# EAGLE schematic motherboard (EAGLE 9.1.2)

## Sheet 1 of 5
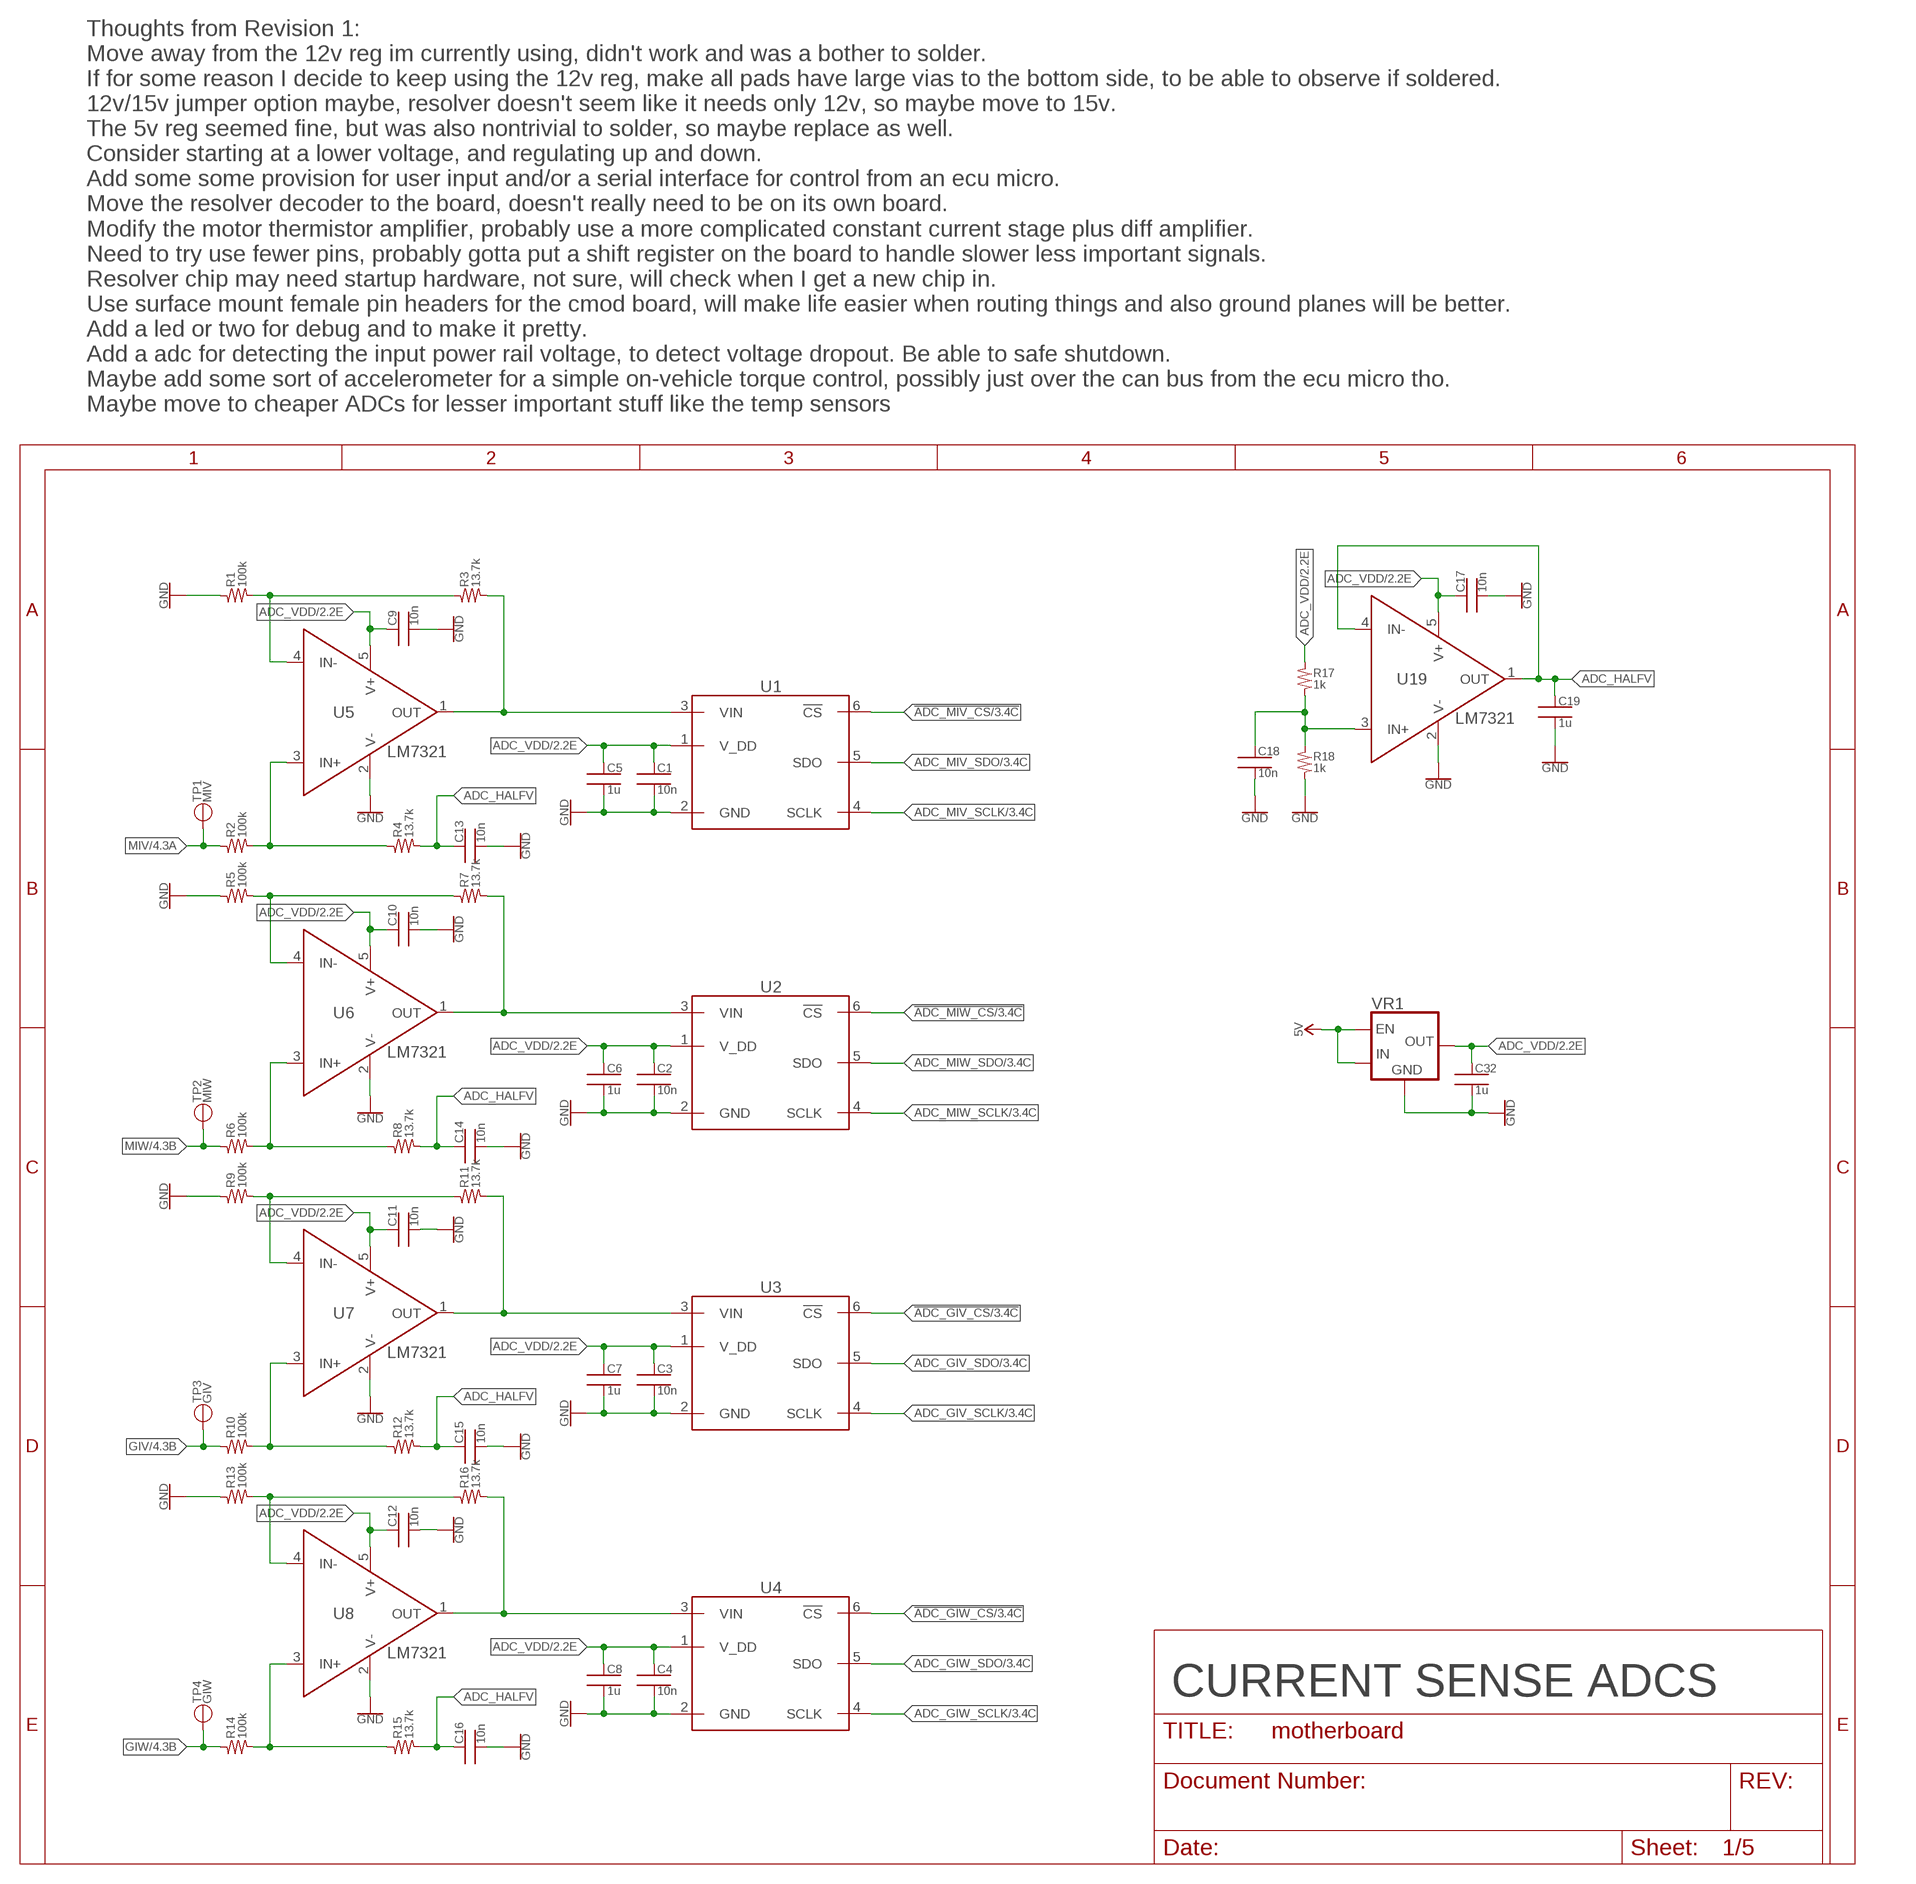
[diagram p0: schematic, sheet 1]

### Parts
C1  10n  CAP_SMD_0402  [0402]
C2  10n  CAP_SMD_0402  [0402]
C3  10n  CAP_SMD_0402  [0402]
C4  10n  CAP_SMD_0402  [0402]
C5  1u  CAP_SMD_0402  [0402]
C6  1u  CAP_SMD_0402  [0402]
C7  1u  CAP_SMD_0402  [0402]
C8  1u  CAP_SMD_0402  [0402]
C9  10n  CAP_SMD_0402  [0402]
C10  10n  CAP_SMD_0402  [0402]
C11  10n  CAP_SMD_0402  [0402]
C12  10n  CAP_SMD_0402  [0402]
C13  10n  CAP_SMD_0402  [0402]
C14  10n  CAP_SMD_0402  [0402]
C15  10n  CAP_SMD_0402  [0402]
C16  10n  CAP_SMD_0402  [0402]
C17  10n  CAP_SMD_0402  [0402]
C18  10n  CAP_SMD_0402  [0402]
C19  1u  CAP_SMD_0402  [0402]
C32  1u  CAP_SMD_0402  [0402]
R1  100k  RES_SMD_0402  [0402]
R2  100k  RES_SMD_0402  [0402]
R3  13.7k  RES_SMD_0402  [0402]
R4  13.7k  RES_SMD_0402  [0402]
R5  100k  RES_SMD_0402  [0402]
R6  100k  RES_SMD_0402  [0402]
R7  13.7k  RES_SMD_0402  [0402]
R8  13.7k  RES_SMD_0402  [0402]
R9  100k  RES_SMD_0402  [0402]
R10  100k  RES_SMD_0402  [0402]
R11  13.7k  RES_SMD_0402  [0402]
R12  13.7k  RES_SMD_0402  [0402]
R13  100k  RES_SMD_0402  [0402]
R14  100k  RES_SMD_0402  [0402]
R15  13.7k  RES_SMD_0402  [0402]
R16  13.7k  RES_SMD_0402  [0402]
R17  1k  RES_SMD_0402  [0402]
R18  1k  RES_SMD_0402  [0402]
TP1  MIV  TESTPOINT_MINI  [1X01_50MIL]
TP2  MIW  TESTPOINT_MINI  [1X01_50MIL]
TP3  GIV  TESTPOINT_MINI  [1X01_50MIL]
TP4  GIW  TESTPOINT_MINI  [1X01_50MIL]
U1  ADS7883  [SOT23-6]
U2  ADS7883  [SOT23-6]
U3  ADS7883  [SOT23-6]
U4  ADS7883  [SOT23-6]
U5  LM7321  [SOT23-5]
U6  LM7321  [SOT23-5]
U7  LM7321  [SOT23-5]
U8  LM7321  [SOT23-5]
U19  LM7321  [SOT23-5]
VR1  TLV733P_SOT23  [SOT23-5]

### Nets
5V: VR1.1(IN) VR1.3(EN) ; also sheet 3,4,5
!ADC_GIV_CS: U3.6(!CS) ; also sheet 3
!ADC_GIW_CS: U4.6(!CS) ; also sheet 3
!ADC_MIV_CS: U1.6(!CS) ; also sheet 3
!ADC_MIW_CS: U2.6(!CS) ; also sheet 3
ADC_GIV_SCLK: U3.4(SCLK) ; also sheet 3
ADC_GIV_SDO: U3.5(SDO) ; also sheet 3
ADC_GIW_SCLK: U4.4(SCLK) ; also sheet 3
ADC_GIW_SDO: U4.5(SDO) ; also sheet 3
ADC_HALFV: C13.1 C14.1 C15.1 C16.1 C19.1 R4.2 R8.2 R12.2 R15.2 U19.1(OUT) U19.4(IN-)
ADC_HALFV_REF: C18.1 R17.2 R18.1 U19.3(IN+)
ADC_MIV_SCLK: U1.4(SCLK) ; also sheet 3
ADC_MIV_SDO: U1.5(SDO) ; also sheet 3
ADC_MIW_SCLK: U2.4(SCLK) ; also sheet 3
ADC_MIW_SDO: U2.5(SDO) ; also sheet 3
ADC_VDD: C1.1 C2.1 C3.1 C4.1 C5.1 C6.1 C7.1 C8.1 C9.1 C10.1 C11.1 C12.1 C17.1 C32.1 R17.1 U1.1(V_DD) U2.1(V_DD) U3.1(V_DD) U4.1(V_DD) U5.5(V+) U6.5(V+) U7.5(V+) U8.5(V+) U19.5(V+) VR1.5(OUT) ; also sheet 2
GIV: R10.1 TP3.1(TP) ; also sheet 4
GIW: R14.1 TP4.1(TP) ; also sheet 4
GND: C1.2 C2.2 C3.2 C4.2 C5.2 C6.2 C7.2 C8.2 C9.2 C10.2 C11.2 C12.2 C13.2 C14.2 C15.2 C16.2 C17.2 C18.2 C19.2 C32.2 R1.1 R5.1 R9.1 R13.1 R18.2 U1.2(GND) U2.2(GND) U3.2(GND) U4.2(GND) U5.2(V-) U6.2(V-) U7.2(V-) U8.2(V-) U19.2(V-) VR1.2(GND) VR1.4(GND) ; also sheet 2,3,4,5
MIV: R2.1 TP1.1(TP) ; also sheet 4
MIW: R6.1 TP2.1(TP) ; also sheet 4
U5_IN+: R2.2 R4.1 U5.3(IN+)
U5_IN-: R1.2 R3.1 U5.4(IN-)
U5_OUT: R3.2 U1.3(VIN) U5.1(OUT)
U6_IN+: R6.2 R8.1 U6.3(IN+)
U6_IN-: R5.2 R7.1 U6.4(IN-)
U6_OUT: R7.2 U2.3(VIN) U6.1(OUT)
U7_IN+: R10.2 R12.1 U7.3(IN+)
U7_IN-: R9.2 R11.1 U7.4(IN-)
U7_OUT: R11.2 U3.3(VIN) U7.1(OUT)
U8_IN+: R14.2 R15.1 U8.3(IN+)
U8_IN-: R13.2 R16.1 U8.4(IN-)
U8_OUT: R16.2 U4.3(VIN) U8.1(OUT)

### Notes on the sheet
- Thoughts from Revision 1:
  Move away from the 12v reg im currently using, didn't work and was a bother to solder.
  If for some reason I decide to keep using the 12v reg, make all pads have large vias to the bottom side, to be able to observe if soldered.
  12v/15v jumper option maybe, resolver doesn't seem like it needs only 12v, so maybe move to 15v.
  The 5v reg seemed fine, but was also nontrivial to solder, so maybe replace as well.
  Consider starting at a lower voltage, and regulating up and down.
  Add some some provision for user input and/or a serial interface for control from an ecu micro.
  Move the resolver decoder to the board, doesn't really need to be on its own board.
  Modify the motor thermistor amplifier, probably use a more complicated constant current stage plus diff amplifier.
  Need to try use fewer pins, probably gotta put a shift register on the board to handle slower less important signals.
  Resolver chip may need startup hardware, not sure, will check when I get a new chip in.
  Use surface mount female pin headers for the cmod board, will make life easier when routing things and also ground planes will be better.
  Add a led or two for debug and to make it pretty. 
  Add a adc for detecting the input power rail voltage, to detect voltage dropout. Be able to safe shutdown.
  Maybe add some sort of accelerometer for a simple on-vehicle torque control, possibly just over the can bus from the ecu micro tho.
  Maybe move to cheaper ADCs for lesser important stuff like the temp sensors
- CURRENT SENSE ADCS

## Sheet 2 of 5
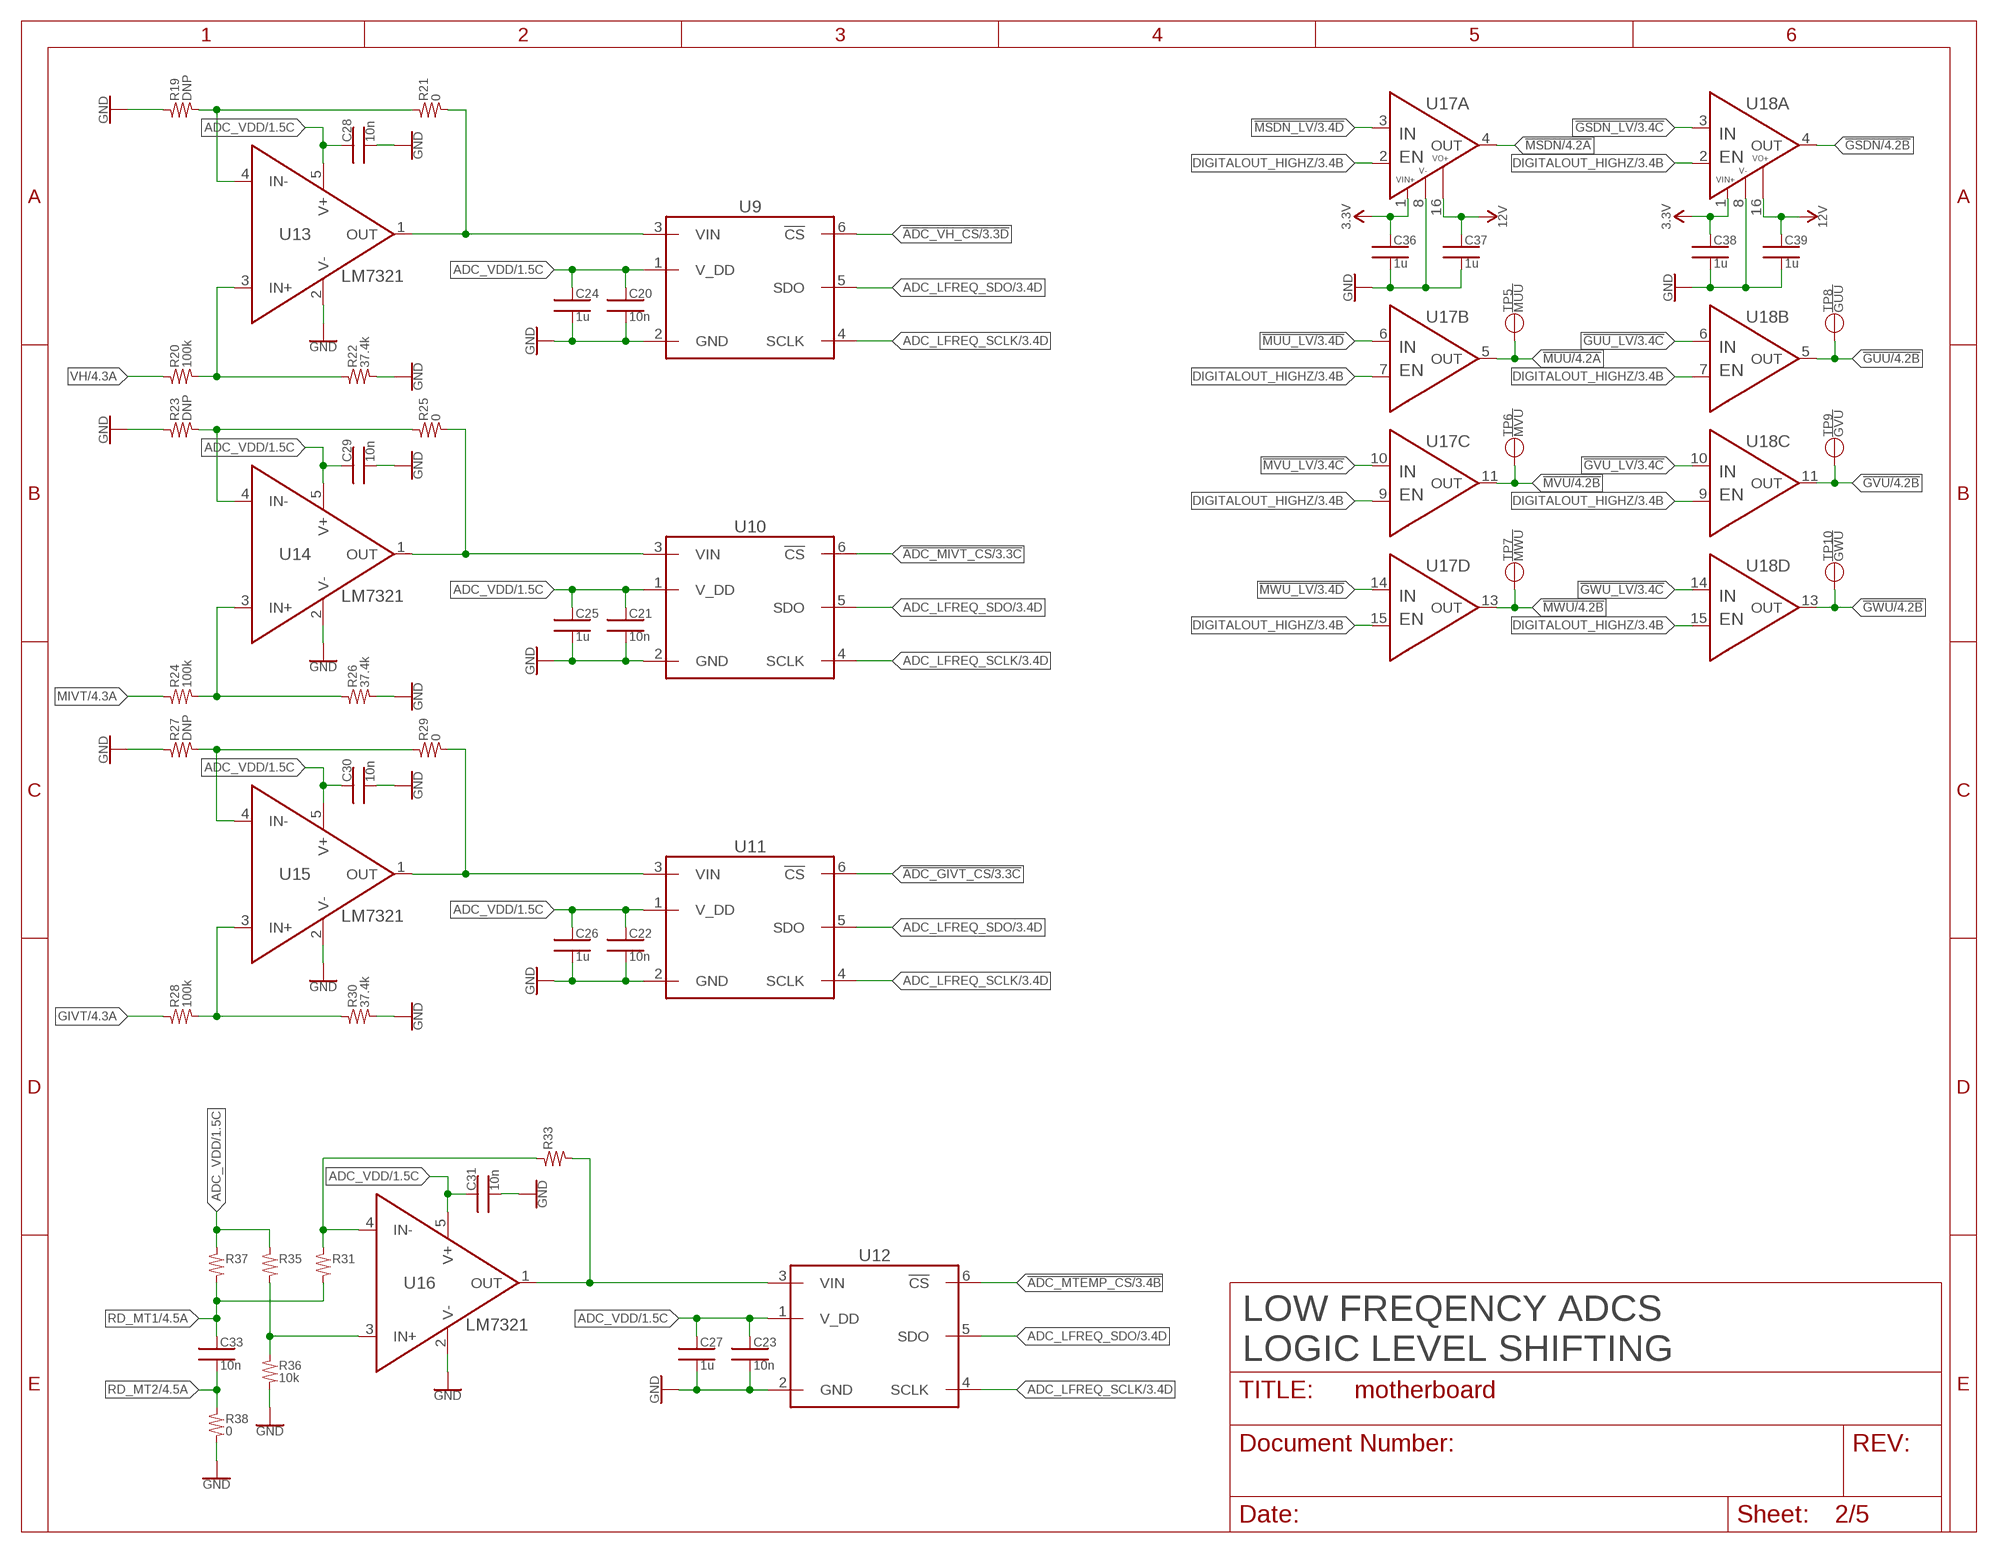
[diagram p1: schematic, sheet 2]

### Parts
C20  10n  CAP_SMD_0402  [0402]
C21  10n  CAP_SMD_0402  [0402]
C22  10n  CAP_SMD_0402  [0402]
C23  10n  CAP_SMD_0402  [0402]
C24  1u  CAP_SMD_0402  [0402]
C25  1u  CAP_SMD_0402  [0402]
C26  1u  CAP_SMD_0402  [0402]
C27  1u  CAP_SMD_0402  [0402]
C28  10n  CAP_SMD_0402  [0402]
C29  10n  CAP_SMD_0402  [0402]
C30  10n  CAP_SMD_0402  [0402]
C31  10n  CAP_SMD_0402  [0402]
C33  10n  CAP_SMD_0402  [0402]
C36  1u  CAP_SMD_0402  [0402]
C37  1u  CAP_SMD_0402  [0402]
C38  1u  CAP_SMD_0402  [0402]
C39  1u  CAP_SMD_0402  [0402]
R19  DNP  RES_SMD_0402  [0402]
R20  100k  RES_SMD_0402  [0402]
R21  0  RES_SMD_0402  [0402]
R22  37.4k  RES_SMD_0402  [0402]
R23  DNP  RES_SMD_0402  [0402]
R24  100k  RES_SMD_0402  [0402]
R25  0  RES_SMD_0402  [0402]
R26  37.4k  RES_SMD_0402  [0402]
R27  DNP  RES_SMD_0402  [0402]
R28  100k  RES_SMD_0402  [0402]
R29  0  RES_SMD_0402  [0402]
R30  37.4k  RES_SMD_0402  [0402]
R31  RES_SMD_0402  [0402]
R33  RES_SMD_0402  [0402]
R35  RES_SMD_0402  [0402]
R36  10k  RES_SMD_0402  [0402]
R37  RES_SMD_0402  [0402]
R38  0  RES_SMD_0402  [0402]
TP5  !MUU  TESTPOINT_MINI  [1X01_50MIL]
TP6  !MVU  TESTPOINT_MINI  [1X01_50MIL]
TP7  !MWU  TESTPOINT_MINI  [1X01_50MIL]
TP8  !GUU  TESTPOINT_MINI  [1X01_50MIL]
TP9  !GVU  TESTPOINT_MINI  [1X01_50MIL]
TP10  !GWU  TESTPOINT_MINI  [1X01_50MIL]
U9  ADS7883  [SOT23-6]
U10  ADS7883  [SOT23-6]
U11  ADS7883  [SOT23-6]
U12  ADS7883  [SOT23-6]
U13  LM7321  [SOT23-5]
U14  LM7321  [SOT23-5]
U15  LM7321  [SOT23-5]
U16  LM7321  [SOT23-5]
U17  CD40109BPWR  [TSSOP-16]
U18  CD40109BPWR  [TSSOP-16]

### Nets
3.3V: C36.1 C38.1 U17.1(A:VIN+) U18.1(A:VIN+) ; also sheet 3,4
12V: C37.1 C39.1 U17.16(A:VOUT+) U18.16(A:VOUT+) ; also sheet 4,5
!ADC_GIVT_CS: U11.6(!CS) ; also sheet 3
!ADC_MIVT_CS: U10.6(!CS) ; also sheet 3
!ADC_MTEMP_CS: U12.6(!CS) ; also sheet 3
!ADC_VH_CS: U9.6(!CS) ; also sheet 3
!GSDN: U18.4(A:OUT) ; also sheet 4
!GSDN_LV: U18.3(A:IN) ; also sheet 3
!GUU: TP8.1(TP) U18.5(B:OUT) ; also sheet 4
!GUU_LV: U18.6(B:IN) ; also sheet 3
!GVU: TP9.1(TP) U18.11(C:OUT) ; also sheet 4
!GVU_LV: U18.10(C:IN) ; also sheet 3
!GWU: TP10.1(TP) U18.13(D:OUT) ; also sheet 4
!GWU_LV: U18.14(D:IN) ; also sheet 3
!MSDN: U17.4(A:OUT) ; also sheet 4
!MSDN_LV: U17.3(A:IN) ; also sheet 3
!MUU: TP5.1(TP) U17.5(B:OUT) ; also sheet 4
!MUU_LV: U17.6(B:IN) ; also sheet 3
!MVU: TP6.1(TP) U17.11(C:OUT) ; also sheet 4
!MVU_LV: U17.10(C:IN) ; also sheet 3
!MWU: TP7.1(TP) U17.13(D:OUT) ; also sheet 4
!MWU_LV: U17.14(D:IN) ; also sheet 3
ADC_LFREQ_SCLK: U9.4(SCLK) U10.4(SCLK) U11.4(SCLK) U12.4(SCLK) ; also sheet 3
ADC_LFREQ_SDO: U9.5(SDO) U10.5(SDO) U11.5(SDO) U12.5(SDO) ; also sheet 3
ADC_VDD: C20.1 C21.1 C22.1 C23.1 C24.1 C25.1 C26.1 C27.1 C28.1 C29.1 C30.1 C31.1 R35.1 R37.1 U9.1(V_DD) U10.1(V_DD) U11.1(V_DD) U12.1(V_DD) U13.5(V+) U14.5(V+) U15.5(V+) U16.5(V+) ; also sheet 1
DIGITALOUT_HIGHZ: U17.2(A:EN) U17.7(B:EN) U17.9(C:EN) U17.15(D:EN) U18.2(A:EN) U18.7(B:EN) U18.9(C:EN) U18.15(D:EN) ; also sheet 3
GIVT: R28.1 ; also sheet 4
GND: C20.2 C21.2 C22.2 C23.2 C24.2 C25.2 C26.2 C27.2 C28.2 C29.2 C30.2 C31.2 C36.2 C37.2 C38.2 C39.2 R19.1 R22.2 R23.1 R26.2 R27.1 R30.2 R36.2 R38.2 U9.2(GND) U10.2(GND) U11.2(GND) U12.2(GND) U13.2(V-) U14.2(V-) U15.2(V-) U16.2(V-) U17.8(A:V-) U18.8(A:V-) ; also sheet 1,3,4,5
MIVT: R24.1 ; also sheet 4
RD_MT1: C33.1 R31.2 R37.2 ; also sheet 4
RD_MT2: C33.2 R38.1 ; also sheet 4
U13_IN+: R20.2 R22.1 U13.3(IN+)
U13_IN-: R19.2 R21.1 U13.4(IN-)
U13_OUT: R21.2 U9.3(VIN) U13.1(OUT)
U14_IN+: R24.2 R26.1 U14.3(IN+)
U14_IN-: R23.2 R25.1 U14.4(IN-)
U14_OUT: R25.2 U10.3(VIN) U14.1(OUT)
U15_IN+: R28.2 R30.1 U15.3(IN+)
U15_IN-: R27.2 R29.1 U15.4(IN-)
U15_OUT: R29.2 U11.3(VIN) U15.1(OUT)
U16_IN+: R35.2 R36.1 U16.3(IN+)
U16_IN-: R31.1 R33.1 U16.4(IN-)
U16_OUT: R33.2 U12.3(VIN) U16.1(OUT)
VH: R20.1 ; also sheet 4

### Notes on the sheet
- LOW FREQENCY ADCS
  LOGIC LEVEL SHIFTING

## Sheet 3 of 5
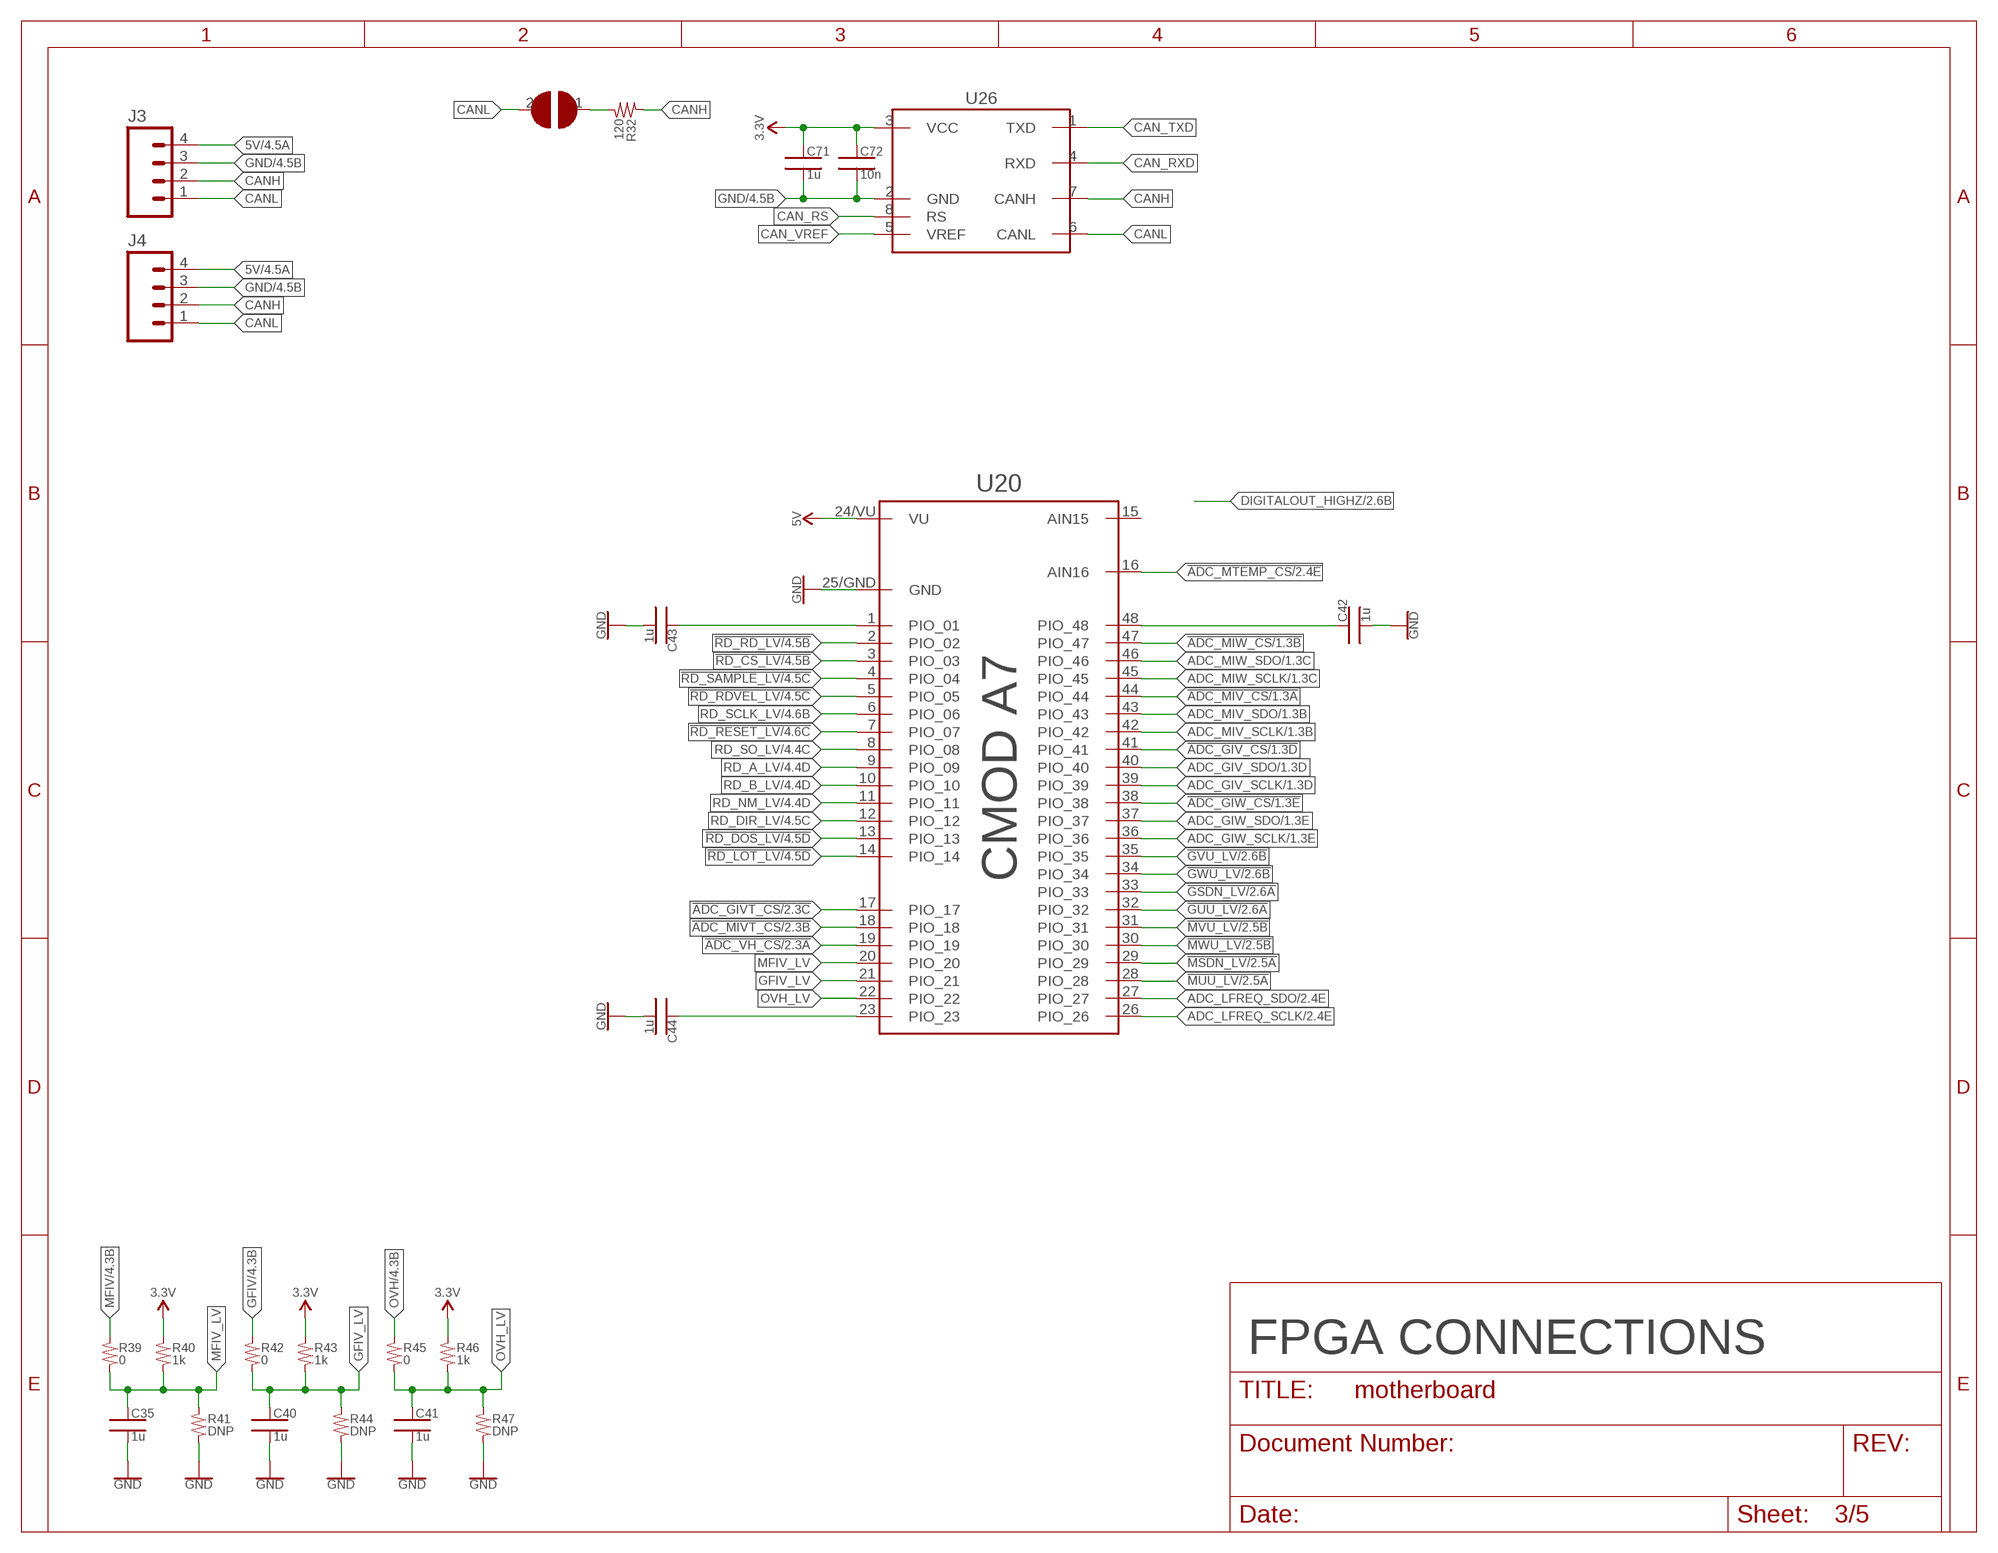
[diagram p2: schematic, sheet 3]

### Parts
C35  1u  CAP_SMD_0402  [0402]
C40  1u  CAP_SMD_0402  [0402]
C41  1u  CAP_SMD_0402  [0402]
C42  1u  CAP_SMD_0402  [0402]
C43  1u  CAP_SMD_0402  [0402]
C44  1u  CAP_SMD_0402  [0402]
C71  1u  CAP_SMD_0402  [0402]
C72  10n  CAP_SMD_0402  [0402]
J3  SM04B-SRSS-TB  [SM04B-SRSS-TB]
J4  SM04B-SRSS-TB  [SM04B-SRSS-TB]
R32  120  RES_SMD_0402  [0402]
R39  0  RES_SMD_0402  [0402]
R40  1k  RES_SMD_0402  [0402]
R41  DNP  RES_SMD_0402  [0402]
R42  0  RES_SMD_0402  [0402]
R43  1k  RES_SMD_0402  [0402]
R44  DNP  RES_SMD_0402  [0402]
R45  0  RES_SMD_0402  [0402]
R46  1k  RES_SMD_0402  [0402]
R47  DNP  RES_SMD_0402  [0402]
SJ1  SOLDERABLE_JUMPER_1POS_NP  [SJ_2S-NO]
U20  CMOD_A7  [CMOD_A7_DIP]
U26  SN65HVD23X  [SOIC_8]

### Nets
3.3V: C71.1 C72.1 R40.1 R43.1 R46.1 U26.3(VCC) ; also sheet 2,4
5V: J3.4 J4.4 U20.24/VU(VU) ; also sheet 1,4,5
!ADC_GIV_CS: U20.41(PIO_41) ; also sheet 1
!ADC_GIVT_CS: U20.17(PIO_17) ; also sheet 2
!ADC_GIW_CS: U20.38(PIO_38) ; also sheet 1
!ADC_MIV_CS: U20.44(PIO_44) ; also sheet 1
!ADC_MIVT_CS: U20.18(PIO_18) ; also sheet 2
!ADC_MIW_CS: U20.47(PIO_47) ; also sheet 1
!ADC_MTEMP_CS: U20.16(AIN16) ; also sheet 2
!ADC_VH_CS: U20.19(PIO_19) ; also sheet 2
!GSDN_LV: U20.33(PIO_33) ; also sheet 2
!GUU_LV: U20.32(PIO_32) ; also sheet 2
!GVU_LV: U20.35(PIO_35) ; also sheet 2
!GWU_LV: U20.34(PIO_34) ; also sheet 2
!MSDN_LV: U20.29(PIO_29) ; also sheet 2
!MUU_LV: U20.28(PIO_28) ; also sheet 2
!MVU_LV: U20.31(PIO_31) ; also sheet 2
!MWU_LV: U20.30(PIO_30) ; also sheet 2
!RD_CS_LV: U20.3(PIO_03) ; also sheet 4
!RD_DOS_LV: U20.13(PIO_13) ; also sheet 4
!RD_LOT_LV: U20.14(PIO_14) ; also sheet 4
!RD_RD_LV: U20.2(PIO_02) ; also sheet 4
!RD_RDVEL_LV: U20.5(PIO_05) ; also sheet 4
!RD_RESET_LV: U20.7(PIO_07) ; also sheet 4
!RD_SAMPLE_LV: U20.4(PIO_04) ; also sheet 4
ADC_GIV_SCLK: U20.39(PIO_39) ; also sheet 1
ADC_GIV_SDO: U20.40(PIO_40) ; also sheet 1
ADC_GIW_SCLK: U20.36(PIO_36) ; also sheet 1
ADC_GIW_SDO: U20.37(PIO_37) ; also sheet 1
ADC_LFREQ_SCLK: U20.26(PIO_26) ; also sheet 2
ADC_LFREQ_SDO: U20.27(PIO_27) ; also sheet 2
ADC_MIV_SCLK: U20.42(PIO_42) ; also sheet 1
ADC_MIV_SDO: U20.43(PIO_43) ; also sheet 1
ADC_MIW_SCLK: U20.45(PIO_45) ; also sheet 1
ADC_MIW_SDO: U20.46(PIO_46) ; also sheet 1
CAN_RS: U26.8(RS)
CAN_RXD: U26.4(RXD)
CAN_TXD: U26.1(TXD)
CAN_VREF: U26.5(VREF)
CANH: J3.2 J4.2 R32.1 U26.7(CANH)
CANL: J3.1 J4.1 SJ1.2 U26.6(CANL)
GFIV: R42.1 ; also sheet 4
GFIV_LV: C40.1 R42.2 R43.2 R44.1 U20.21(PIO_21)
GND: C35.2 C40.2 C41.2 C42.2 C43.2 C44.2 C71.2 C72.2 J3.3 J4.3 R41.2 R44.2 R47.2 U20.25/GND(GND) U26.2(GND) ; also sheet 1,2,4,5
MFIV: R39.1 ; also sheet 4
MFIV_LV: C35.1 R39.2 R40.2 R41.1 U20.20(PIO_20)
N$2: R32.2 SJ1.1
OVH: R45.1 ; also sheet 4
OVH_LV: C41.1 R45.2 R46.2 R47.1 U20.22(PIO_22)
PIO_01: C43.1 U20.1(PIO_01)
PIO_23: C44.1 U20.23(PIO_23)
PIO_48: C42.1 U20.48(PIO_48)
RD_A_LV: U20.9(PIO_09) ; also sheet 4
RD_B_LV: U20.10(PIO_10) ; also sheet 4
RD_DIR_LV: U20.12(PIO_12) ; also sheet 4
RD_NM_LV: U20.11(PIO_11) ; also sheet 4
RD_SCLK_LV: U20.6(PIO_06) ; also sheet 4
RD_SO_LV: U20.8(PIO_08) ; also sheet 4
Unconnected: U20.15(AIN15)

### Notes on the sheet
- FPGA CONNECTIONS

## Sheet 4 of 5
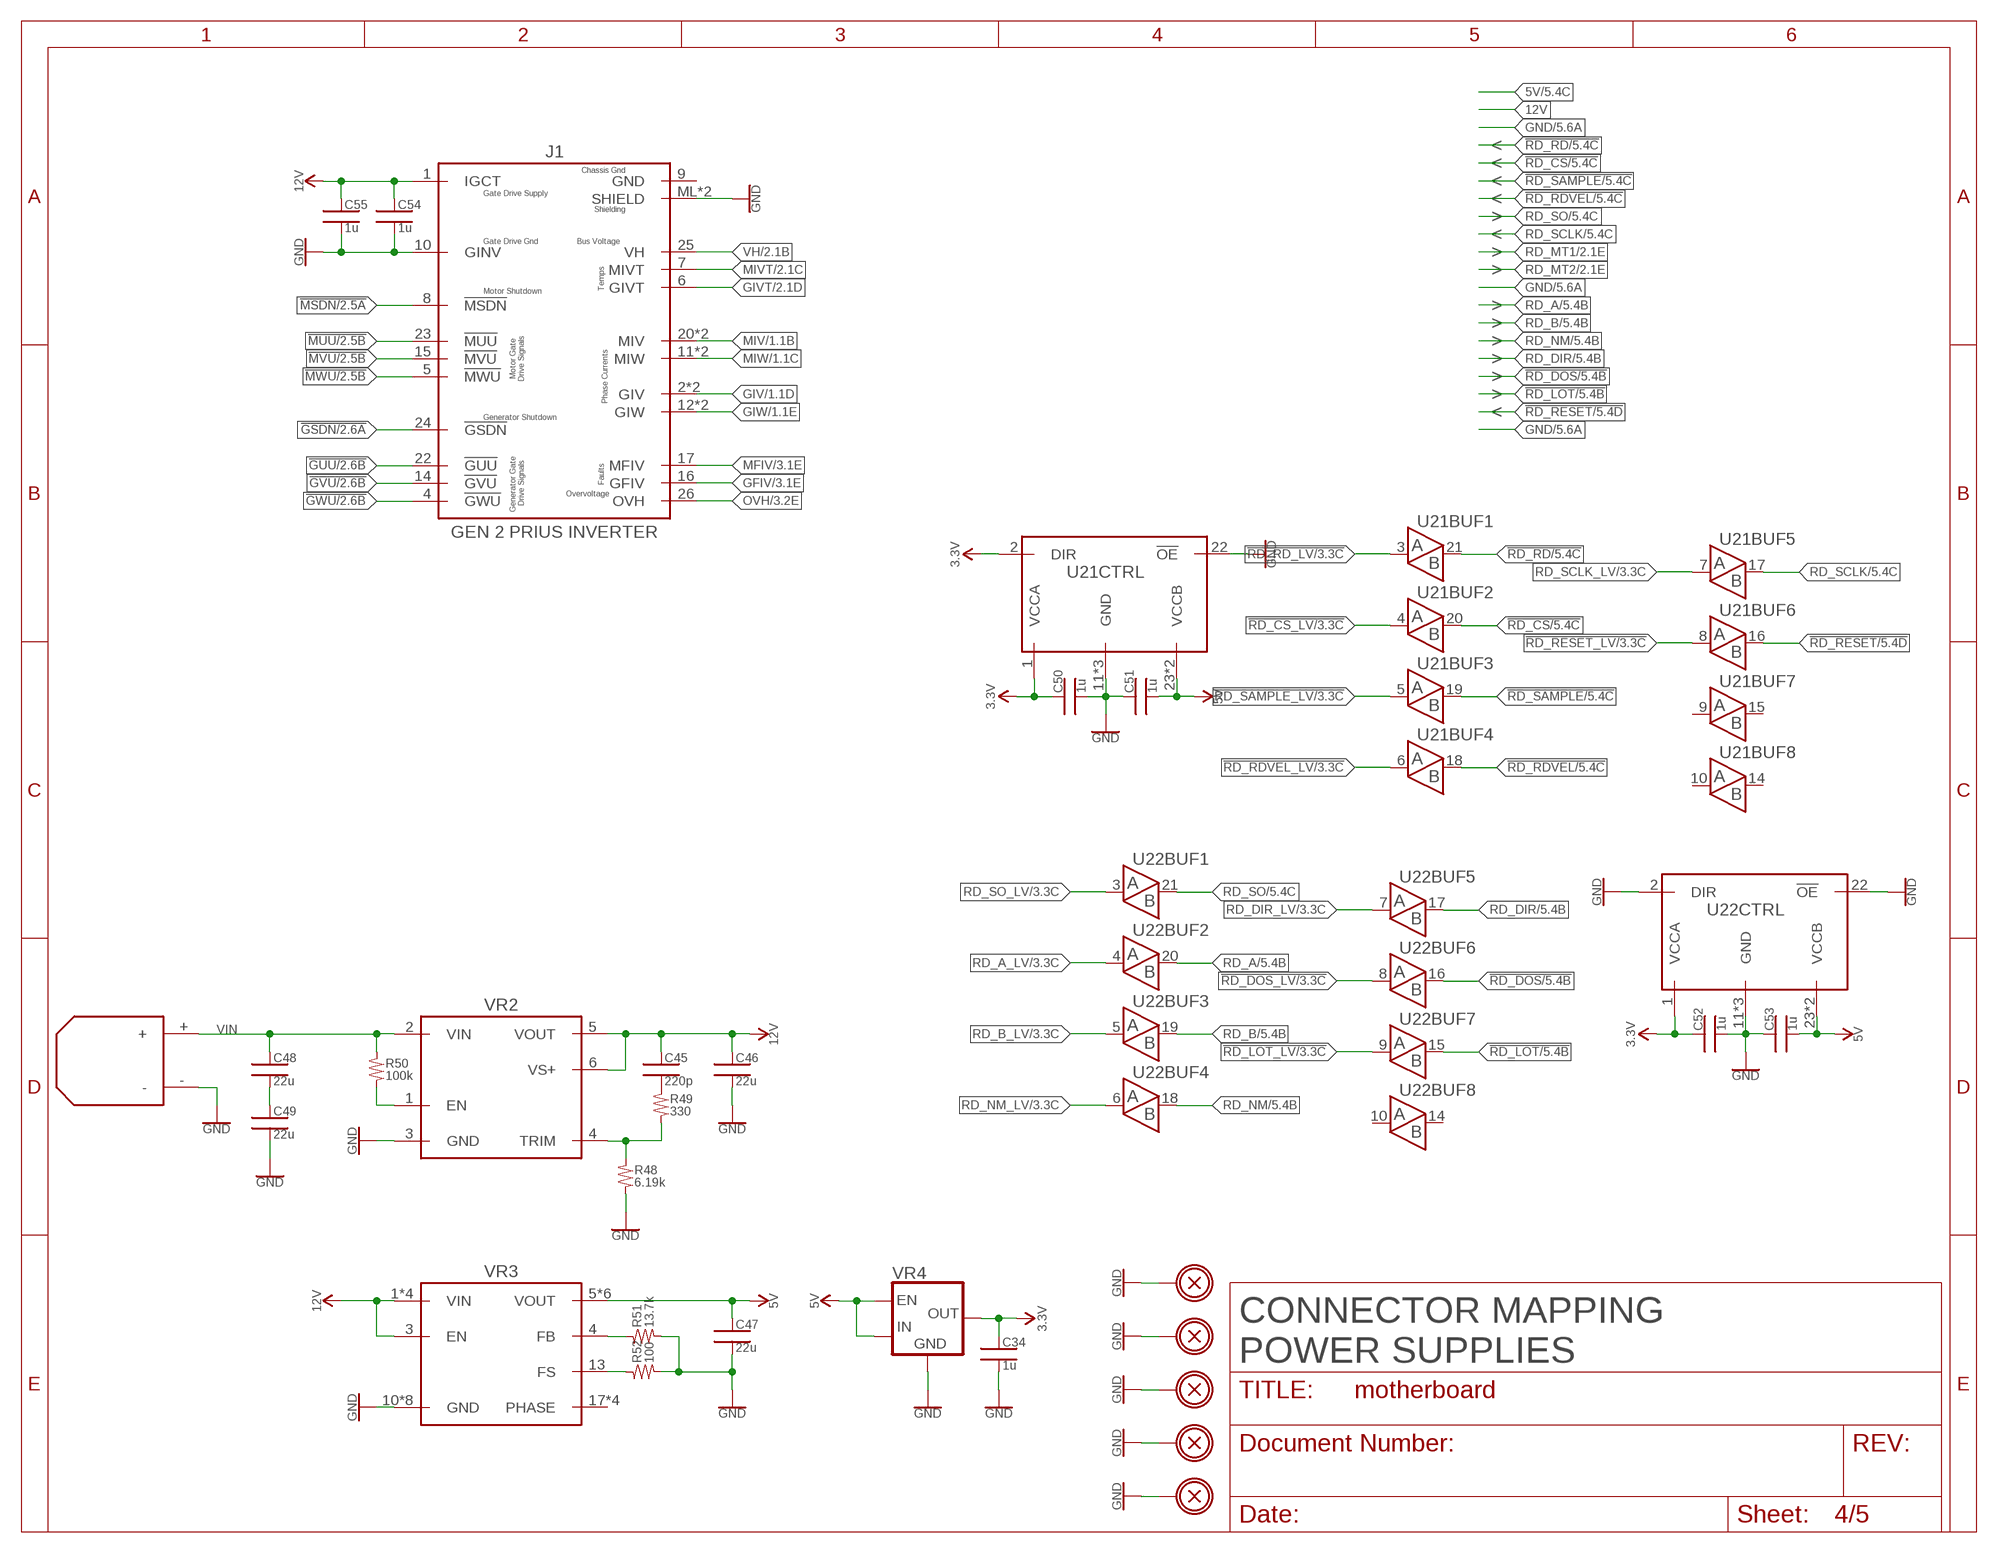
[diagram p3: schematic, sheet 4]

### Parts
C34  1u  CAP_SMD_0402  [0402]
C45  220p  CAP_SMD_0402  [0402]
C46  22u  CAP_SMD_1210  [1210]
C47  22u  CAP_SMD_1210  [1210]
C48  22u  CAP_SMD_1210  [1210]
C49  22u  CAP_SMD_1210  [1210]
C50  1u  CAP_SMD_0402  [0402]
C51  1u  CAP_SMD_0402  [0402]
C52  1u  CAP_SMD_0402  [0402]
C53  1u  CAP_SMD_0402  [0402]
C54  1u  CAP_SMD_0402  [0402]
C55  1u  CAP_SMD_0402  [0402]
H1  BOLTHOLE_M3  [M3_HOLE]
H2  BOLTHOLE_M3  [M3_HOLE]
H3  BOLTHOLE_M3  [M3_HOLE]
H4  BOLTHOLE_M3  [M3_HOLE]
H5  BOLTHOLE_M3  [M3_HOLE]
J1  PRIUS_INV_DB26  [L17HTHA]
R48  6.19k  RES_SMD_0402  [0402]
R49  330  RES_SMD_0402  [0402]
R50  100k  RES_SMD_0402  [0402]
R51  13.7k  RES_SMD_0402  [0402]
R52  100  RES_SMD_0402  [0402]
U21  74LVC8T245  [TSSOP-24]
U22  74LVC8T245  [TSSOP-24]
U$1  XT30  [XT30_HORIZONTAL]
VR2  PROLYNX  [PROLYNX]
VR3  MUN24AD03-SM  [UPOL_PWR_MODULE]
VR4  TLV733P_SOT23  [SOT23-5]

### Nets
3.3V: C34.1 C50.1 C52.1 U21.1(CTRL:VCCA) U21.2(CTRL:DIR) U22.1(CTRL:VCCA) VR4.5(OUT) ; also sheet 2,3
5V: C47.1 C51.2 C53.2 U21.23(CTRL:VCCB) U21.24(CTRL:VCCB) U22.23(CTRL:VCCB) U22.24(CTRL:VCCB) VR3.5(VOUT) VR3.6(VOUT) VR3.7(VOUT) VR3.8(VOUT) VR3.9(VOUT) VR3.24(VOUT) VR4.1(IN) VR4.3(EN) ; also sheet 1,3,5
12V: C45.1 C46.1 C54.1 C55.1 J1.1(IGCT) VR2.5(VOUT) VR2.6(VS+) VR3.1(VIN) VR3.2(VIN) VR3.3(EN) VR3.20(VIN) VR3.21(VIN) ; also sheet 2,5
!GSDN: J1.24(!GSDN) ; also sheet 2
!GUU: J1.22(!GUU) ; also sheet 2
!GVU: J1.14(!GVU) ; also sheet 2
!GWU: J1.4(!GWU) ; also sheet 2
!MSDN: J1.8(!MSDN) ; also sheet 2
!MUU: J1.23(!MUU) ; also sheet 2
!MVU: J1.15(!MVU) ; also sheet 2
!MWU: J1.5(!MWU) ; also sheet 2
!RD_CS: U21.20(BUF2:B) ; also sheet 5
!RD_CS_LV: U21.4(BUF2:A) ; also sheet 3
!RD_DOS: U22.16(BUF6:B) ; also sheet 5
!RD_DOS_LV: U22.8(BUF6:A) ; also sheet 3
!RD_LOT: U22.15(BUF7:B) ; also sheet 5
!RD_LOT_LV: U22.9(BUF7:A) ; also sheet 3
!RD_RD: U21.21(BUF1:B) ; also sheet 5
!RD_RD_LV: U21.3(BUF1:A) ; also sheet 3
!RD_RDVEL: U21.18(BUF4:B) ; also sheet 5
!RD_RDVEL_LV: U21.6(BUF4:A) ; also sheet 3
!RD_RESET: U21.16(BUF6:B) ; also sheet 5
!RD_RESET_LV: U21.8(BUF6:A) ; also sheet 3
!RD_SAMPLE: U21.19(BUF3:B) ; also sheet 5
!RD_SAMPLE_LV: U21.5(BUF3:A) ; also sheet 3
GFIV: J1.16(GFIV) ; also sheet 3
GIV: J1.2(GIV) J1.3(GIV) ; also sheet 1
GIVT: J1.6(GIVT) ; also sheet 2
GIW: J1.12(GIW) J1.13(GIW) ; also sheet 1
GND: C34.2 C46.2 C47.2 C49.2 C50.2 C51.1 C52.2 C53.1 C54.2 C55.2 H1.P H2.P H3.P H4.P H5.P J1.10(GINV) J1.ML(SHIELD) J1.MR(SHIELD) R48.2 R51.2 R52.2 U21.11(CTRL:GND) U21.12(CTRL:GND) U21.13(CTRL:GND) U21.22(CTRL:!OE) U22.2(CTRL:DIR) U22.11(CTRL:GND) U22.12(CTRL:GND) U22.13(CTRL:GND) U22.22(CTRL:!OE) U$1.- VR2.3(GND) VR3.10(GND) VR3.11(GND) VR3.12(GND) VR3.14(GND) VR3.15(GND) VR3.16(GND) VR3.23(GND) VR3.25(GND) VR4.2(GND) VR4.4(GND) ; also sheet 1,2,3,5
MFIV: J1.17(MFIV) ; also sheet 3
MIV: J1.20(MIV) J1.21(MIV) ; also sheet 1
MIVT: J1.7(MIVT) ; also sheet 2
MIW: J1.11(MIW) J1.19(MIW) ; also sheet 1
N$9: C45.2 R49.1
OVH: J1.26(OVH) ; also sheet 3
RD_A: U22.20(BUF2:B) ; also sheet 5
RD_A_LV: U22.4(BUF2:A) ; also sheet 3
RD_B: U22.19(BUF3:B) ; also sheet 5
RD_B_LV: U22.5(BUF3:A) ; also sheet 3
RD_DIR: U22.17(BUF5:B) ; also sheet 5
RD_DIR_LV: U22.7(BUF5:A) ; also sheet 3
RD_NM: U22.18(BUF4:B) ; also sheet 5
RD_NM_LV: U22.6(BUF4:A) ; also sheet 3
RD_SCLK: U21.17(BUF5:B) ; also sheet 5
RD_SCLK_LV: U21.7(BUF5:A) ; also sheet 3
RD_SO: U22.21(BUF1:B) ; also sheet 5
RD_SO_LV: U22.3(BUF1:A) ; also sheet 3
VH: J1.25(VH) ; also sheet 2
VIN: C48.1 R50.1 U$1.+ VR2.2(VIN)
VIN_BYP_MID: C48.2 C49.1
VR2_EN: R50.2 VR2.1(EN)
VR2_TRIM: R48.1 R49.2 VR2.4(TRIM)
VR3_FB: R51.1 VR3.4(FB)
VR3_FS: R52.1 VR3.13(FS)
Unconnected: J1.9(GND) U21.9(BUF7:A) U21.10(BUF8:A) U21.14(BUF8:B) U21.15(BUF7:B) U22.10(BUF8:A) U22.14(BUF8:B) VR3.17(PHASE) VR3.18(PHASE) VR3.19(PHASE) VR3.22(PHASE)

### Notes on the sheet
- <
- <
- <
- <
- >
- <
- >
- >
- >
- >
- >
- >
- >
- >
- <
- CONNECTOR MAPPING
  POWER SUPPLIES

## Sheet 5 of 5
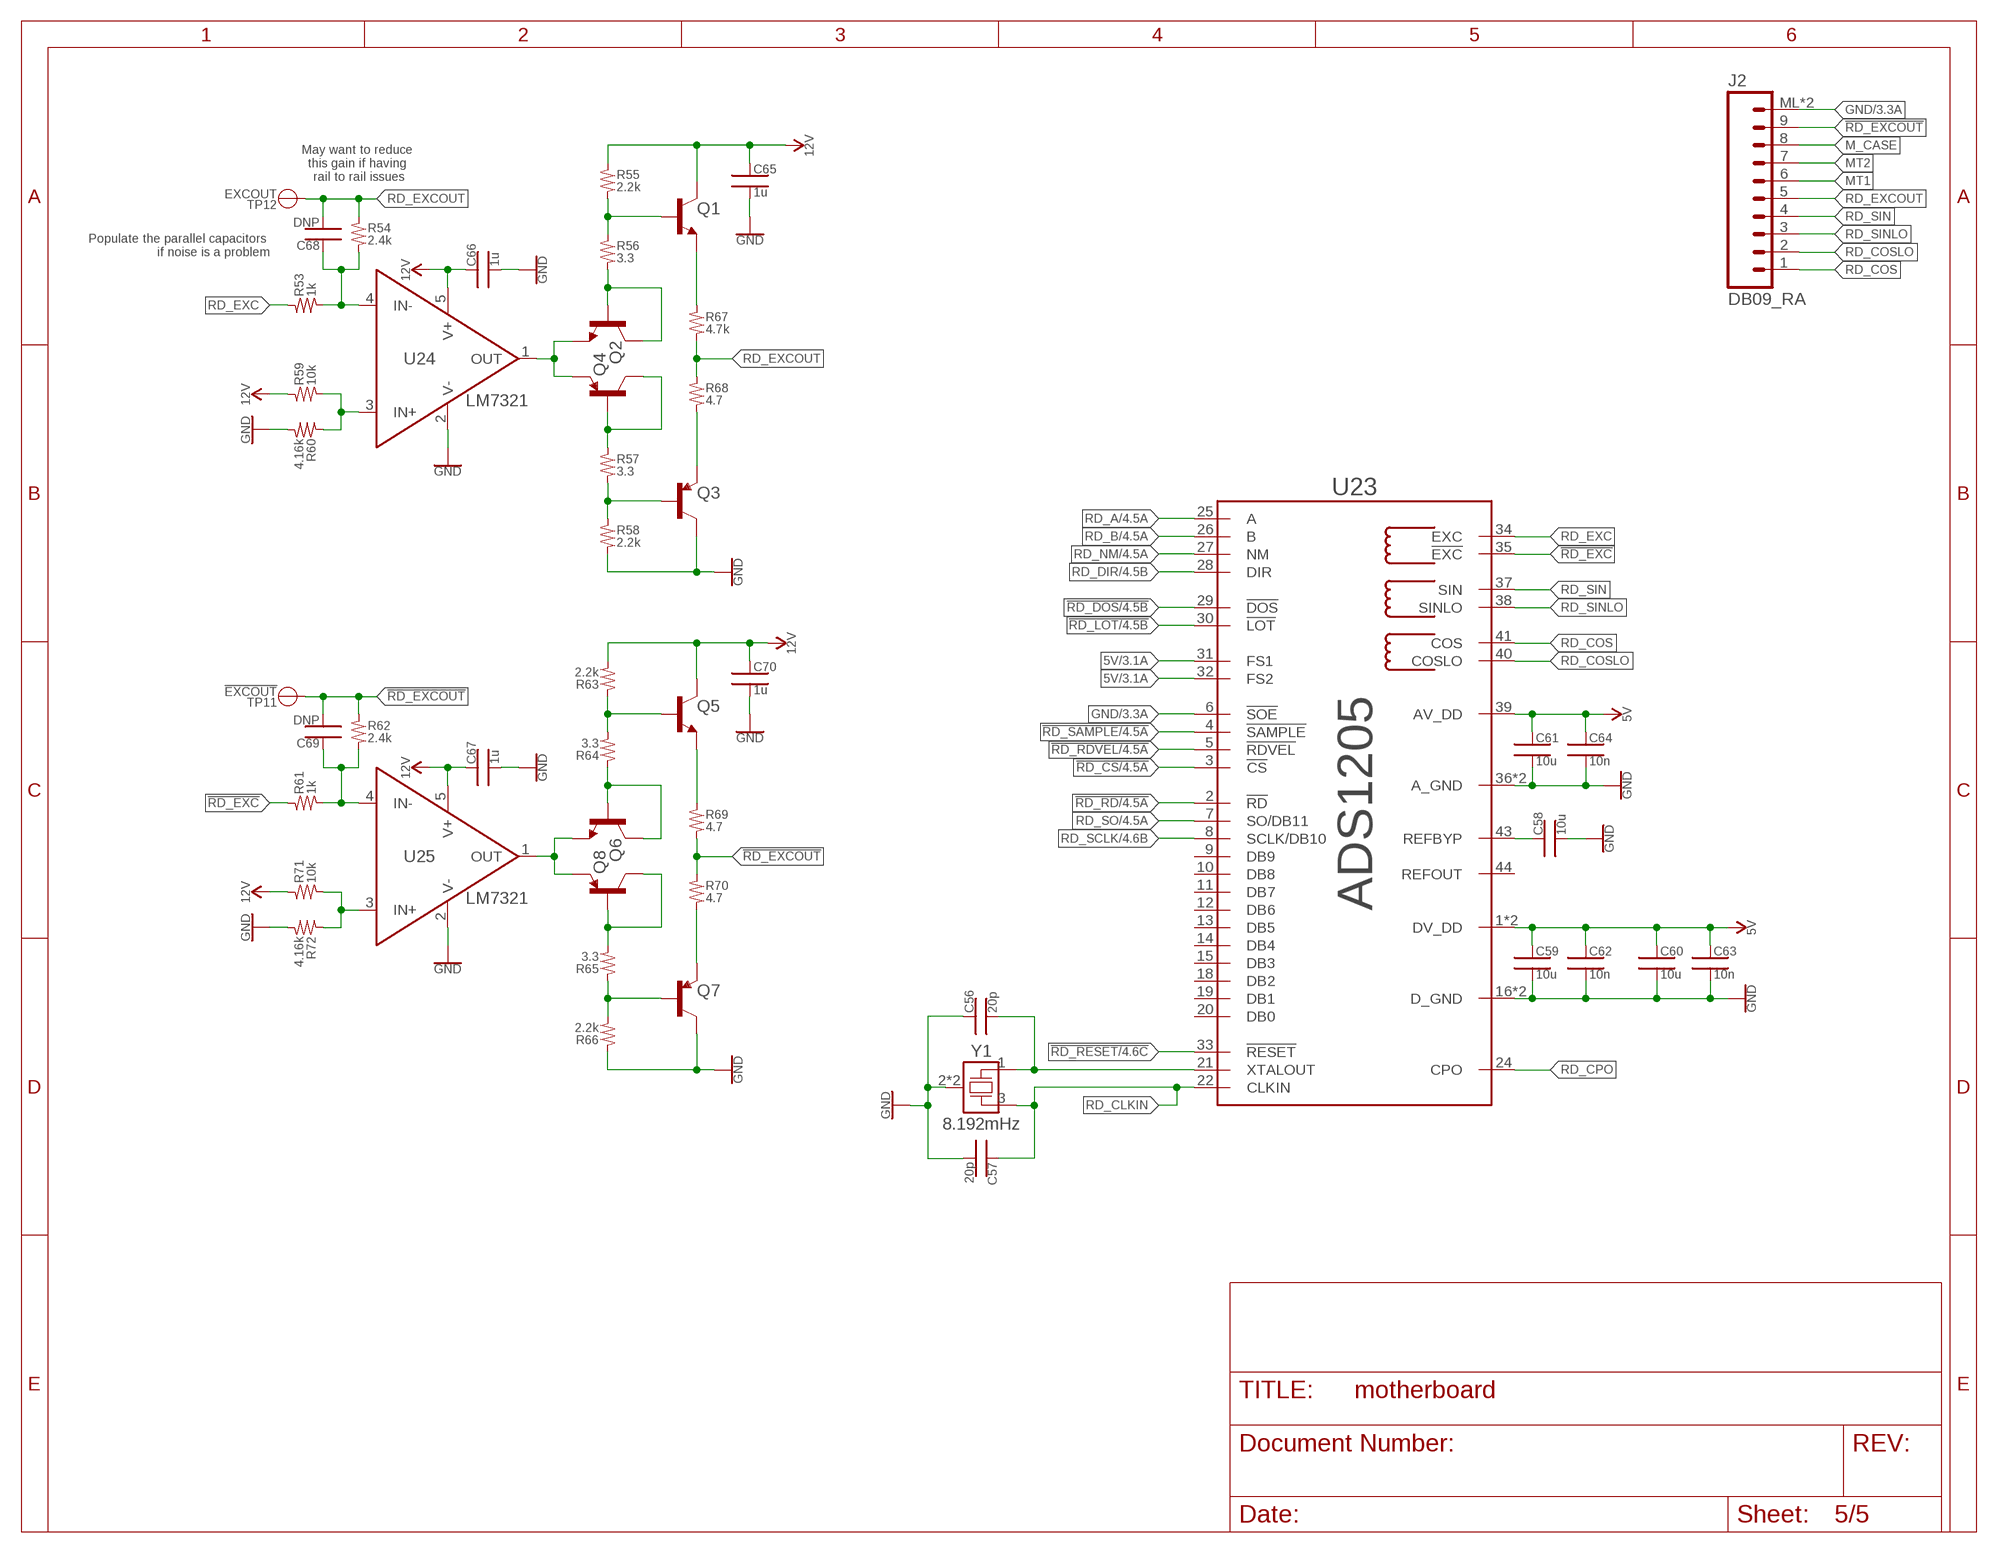
[diagram p4: schematic, sheet 5]

### Parts
C56  20p  CAP_SMD_0402  [0402]
C57  20p  CAP_SMD_0402  [0402]
C58  10u  CAP_SMD_0603  [0603]
C59  10u  CAP_SMD_0603  [0603]
C60  10u  CAP_SMD_0603  [0603]
C61  10u  CAP_SMD_0603  [0603]
C62  10n  CAP_SMD_0402  [0402]
C63  10n  CAP_SMD_0402  [0402]
C64  10n  CAP_SMD_0402  [0402]
C65  1u  CAP_SMD_0402  [0402]
C66  1u  CAP_SMD_0402  [0402]
C67  1u  CAP_SMD_0402  [0402]
C68  DNP  CAP_SMD_0402  [0402]
C69  DNP  CAP_SMD_0402  [0402]
C70  1u  CAP_SMD_0402  [0402]
J2  DB09_RA  [AE10921]
Q1  BJT_NPN  [SOT23-3]
Q2  BJT_NPN  [SOT23-3]
Q3  BJT_PNP  [SOT23-3]
Q4  BJT_PNP  [SOT23-3]
Q5  BJT_NPN  [SOT23-3]
Q6  BJT_NPN  [SOT23-3]
Q7  BJT_PNP  [SOT23-3]
Q8  BJT_PNP  [SOT23-3]
R53  1k  RES_SMD_0402  [0402]
R54  2.4k  RES_SMD_0402  [0402]
R55  2.2k  RES_SMD_0402  [0402]
R56  3.3  RES_SMD_0402  [0402]
R57  3.3  RES_SMD_0402  [0402]
R58  2.2k  RES_SMD_0402  [0402]
R59  10k  RES_SMD_0402  [0402]
R60  4.16k  RES_SMD_0402  [0402]
R61  1k  RES_SMD_0402  [0402]
R62  2.4k  RES_SMD_0402  [0402]
R63  2.2k  RES_SMD_0402  [0402]
R64  3.3  RES_SMD_0402  [0402]
R65  3.3  RES_SMD_0402  [0402]
R66  2.2k  RES_SMD_0402  [0402]
R67  4.7k  RES_SMD_0805  [0805]
R68  4.7  RES_SMD_0805  [0805]
R69  4.7  RES_SMD_0805  [0805]
R70  4.7  RES_SMD_0805  [0805]
R71  10k  RES_SMD_0402  [0402]
R72  4.16k  RES_SMD_0402  [0402]
TP11  !EXCOUT  TESTPOINT_MINI  [1X01_50MIL]
TP12  EXCOUT  TESTPOINT_MINI  [1X01_50MIL]
U23  ADS1205  [LQFP44]
U24  LM7321  [SOT23-5]
U25  LM7321  [SOT23-5]
Y1  8.192mHz  LFXTAL061486  [5X3.2MM_SMD_XTAL]

### Nets
5V: C59.1 C60.1 C61.1 C62.1 C63.1 C64.1 U23.1(DV_DD) U23.17(DV_DD) U23.31(FS1) U23.32(FS2) U23.39(AV_DD) ; also sheet 1,3,4
12V: C65.1 C66.1 C67.1 C70.1 Q1.3(C) Q5.3(C) R55.1 R59.1 R63.2 R71.1 U24.5(V+) U25.5(V+) ; also sheet 2,4
!RD_CS: U23.3(!CS) ; also sheet 4
!RD_DOS: U23.29(!DOS) ; also sheet 4
!RD_EXC: R61.1 U23.35(!EXC)
!RD_EXCOUT: C69.2 J2.9 R62.1 R69.2 R70.1 TP11.1(TP)
!RD_LOT: U23.30(!LOT) ; also sheet 4
!RD_RD: U23.2(!RD) ; also sheet 4
!RD_RDVEL: U23.5(!RDVEL) ; also sheet 4
!RD_RESET: U23.33(!RESET) ; also sheet 4
!RD_SAMPLE: U23.4(!SAMPLE) ; also sheet 4
GND: C56.1 C57.2 C58.2 C59.2 C60.2 C61.2 C62.2 C63.2 C64.2 C65.2 C66.2 C67.2 C70.2 J2.ML J2.MR Q3.3(C) Q7.3(C) R58.2 R60.2 R66.1 R72.2 U23.6(!SOE) U23.16(D_GND) U23.23(D_GND) U23.36(A_GND) U23.42(A_GND) U24.2(V-) U25.2(V-) Y1.2(CASE) Y1.4(CASE) ; also sheet 1,2,3,4
M_CASE: J2.8
MT1: J2.6
MT2: J2.7
Q1_BASE: Q1.1(B) R55.2 R56.1
Q1_EMITTER: Q1.2(E) R67.1
Q2_BC: Q2.1(B) Q2.3(C) R56.2
Q3_BASE: Q3.1(B) R57.2 R58.1
Q3_EMITTER: Q3.2(E) R68.2
Q4_BC: Q4.1(B) Q4.3(C) R57.1
Q5_BASE: Q5.1(B) R63.1 R64.2
Q5_EMITTER: Q5.2(E) R69.1
Q6_BC: Q6.1(B) Q6.3(C) R64.1
Q7_BASE: Q7.1(B) R65.1 R66.2
Q7_EMITTER: Q7.2(E) R70.2
Q8_BC: Q8.1(B) Q8.3(C) R65.2
RD_A: U23.25(A) ; also sheet 4
RD_B: U23.26(B) ; also sheet 4
RD_CLKIN: C57.1 U23.22(CLKIN) Y1.3(X2)
RD_COS: J2.1 U23.41(COS)
RD_COSLO: J2.2 U23.40(COSLO)
RD_CPO: U23.24(CPO)
RD_DIR: U23.28(DIR) ; also sheet 4
RD_EXC: R53.1 U23.34(EXC)
RD_EXCOUT: C68.2 J2.5 R54.1 R67.2 R68.1 TP12.1(TP)
RD_NM: U23.27(NM) ; also sheet 4
RD_REFBYP: C58.1 U23.43(REFBYP)
RD_SCLK: U23.8(SCLK/DB10) ; also sheet 4
RD_SIN: J2.4 U23.37(SIN)
RD_SINLO: J2.3 U23.38(SINLO)
RD_SO: U23.7(SO/DB11) ; also sheet 4
RD_XTALOUT: C56.2 U23.21(XTALOUT) Y1.1(X1)
U24_IN+: R59.2 R60.1 U24.3(IN+)
U24_IN-: C68.1 R53.2 R54.2 U24.4(IN-)
U24_OUT: Q2.2(E) Q4.2(E) U24.1(OUT)
U25_IN+: R71.2 R72.1 U25.3(IN+)
U25_IN-: C69.1 R61.2 R62.2 U25.4(IN-)
U25_OUT: Q6.2(E) Q8.2(E) U25.1(OUT)
Unconnected: U23.9(DB9) U23.10(DB8) U23.11(DB7) U23.12(DB6) U23.13(DB5) U23.14(DB4) U23.15(DB3) U23.18(DB2) U23.19(DB1) U23.20(DB0) U23.44(REFOUT)

### Notes on the sheet
- May want to reduce 
  this gain if having 
  rail to rail issues
- Populate the parallel capacitors 
  if noise is a problem

## Library data of the parts
C1-C72 = FPGA_FOC_lib:CAP_SMD
H1-H5 = FPGA_FOC_lib:BOLTHOLE
J1 = FPGA_FOC_lib:PRIUS_INV: Connection for a Gen2 Prius inverter module
J2 = FPGA_FOC_lib:DB09
J3 J4 = FPGA_FOC_lib:?M04B-SRSS-TB: Disconnectable Crimp style connector, 1.0mm pitch 4 contacts
Q1 Q2 Q5 Q6 = FPGA_FOC_lib:BJT_NPN
Q3 Q4 Q7 Q8 = FPGA_FOC_lib:BJT_PNP: Generic NPN Bipolar transistor
R1-R33 R35-R72 = FPGA_FOC_lib:RES_SMD
SJ1 = FPGA_FOC_lib:SOLDERABLE_JUMPER_1POS: A solderable two pin jumper with different solder paste options to preshort the pads
TP1-TP12 = FPGA_FOC_lib:TESTPOINT: A simple test point with multiple ways to tap off a signal
U1-U4 U9-U12 = FPGA_FOC_lib:ADS7883: 12-BIT, 3-MSPS, MICROPOWER, MINIATURE SAR ADC http://www.ti.com/lit/ds/symlink/ads7883.pdf
U5-U8 U13-U16 U19 U24 U25 = FPGA_FOC_lib:LM7321: Rail-to-Rail Input and Output ±15-V (2.5v-32v), High-Output Current and Unlimited Capacitive Load Operational Amplifier http://www.ti.com/lit/ds/symlink/lm7321.pdf
U17 U18 = FPGA_FOC_lib:CD40109B: Quad 20v tri-state logic level shifter, low to high http://www.ti.com/lit/ds/symlink/cd40109b.pdf
U20 = FPGA_FOC_lib:CMOD_A7: 15T and 35T
U21 U22 = FPGA_FOC_lib:74LVC8T245: 8 channel bidirectional 1.2-5.5v logic level shifter with combined OE (datasheet) <https://assets.nexperia.com/documents/data-sheet/74LVC_LVCH8T245.pdf>
U23 = FPGA_FOC_lib:ADS1205: AD2S1205 Resolver decoder
U26 = FPGA_FOC_lib:SN65HVD23X: SN65HVD23x 3.3-V CAN Bus Transceivers datasheet <http://www.ti.com/lit/ds/symlink/sn65hvd230.pdf>
U$1 = FPGA_FOC_lib:XT30
VR1 VR4 = FPGA_FOC_lib:TLV733P: Cap-Free 300ma 5v to 3.3v linear regulator (datasheet) <https://www.digikey.com/product-detail/en/texas-instruments/TLV73333PDBVR/296-40673-1-ND/5178550>
VR2 = FPGA_FOC_lib:PROLYNX: Non-isolated 9-36v, 3A, Up-Down DC-DC converter (datasheet) <http://apps.geindustrial.com/publibrary/checkout/APXW003A0X?TNR=Data%20Sheets|APXW003A0X|generic>
VR3 = FPGA_FOC_lib:MUN24AD03-SM: 8-34v in 5-12v out 3A non-isolated DC-DC converter (datasheet) <http://www.cyntec.com/upfile/products/download/Cyntec_MUN24AD03-SM_datasheet_Rev.pdf>
Y1 = FPGA_FOC_lib:LFXTAL061486: 8.192 MHz crystal, load cap=10pf (2x20pf), (datasheet) <https://www.iqdfrequencyproducts.com/products/pn/LFXTAL061486Reel.pdf>